# EAGLE design 2016_A_mother (EAGLE 6.2)
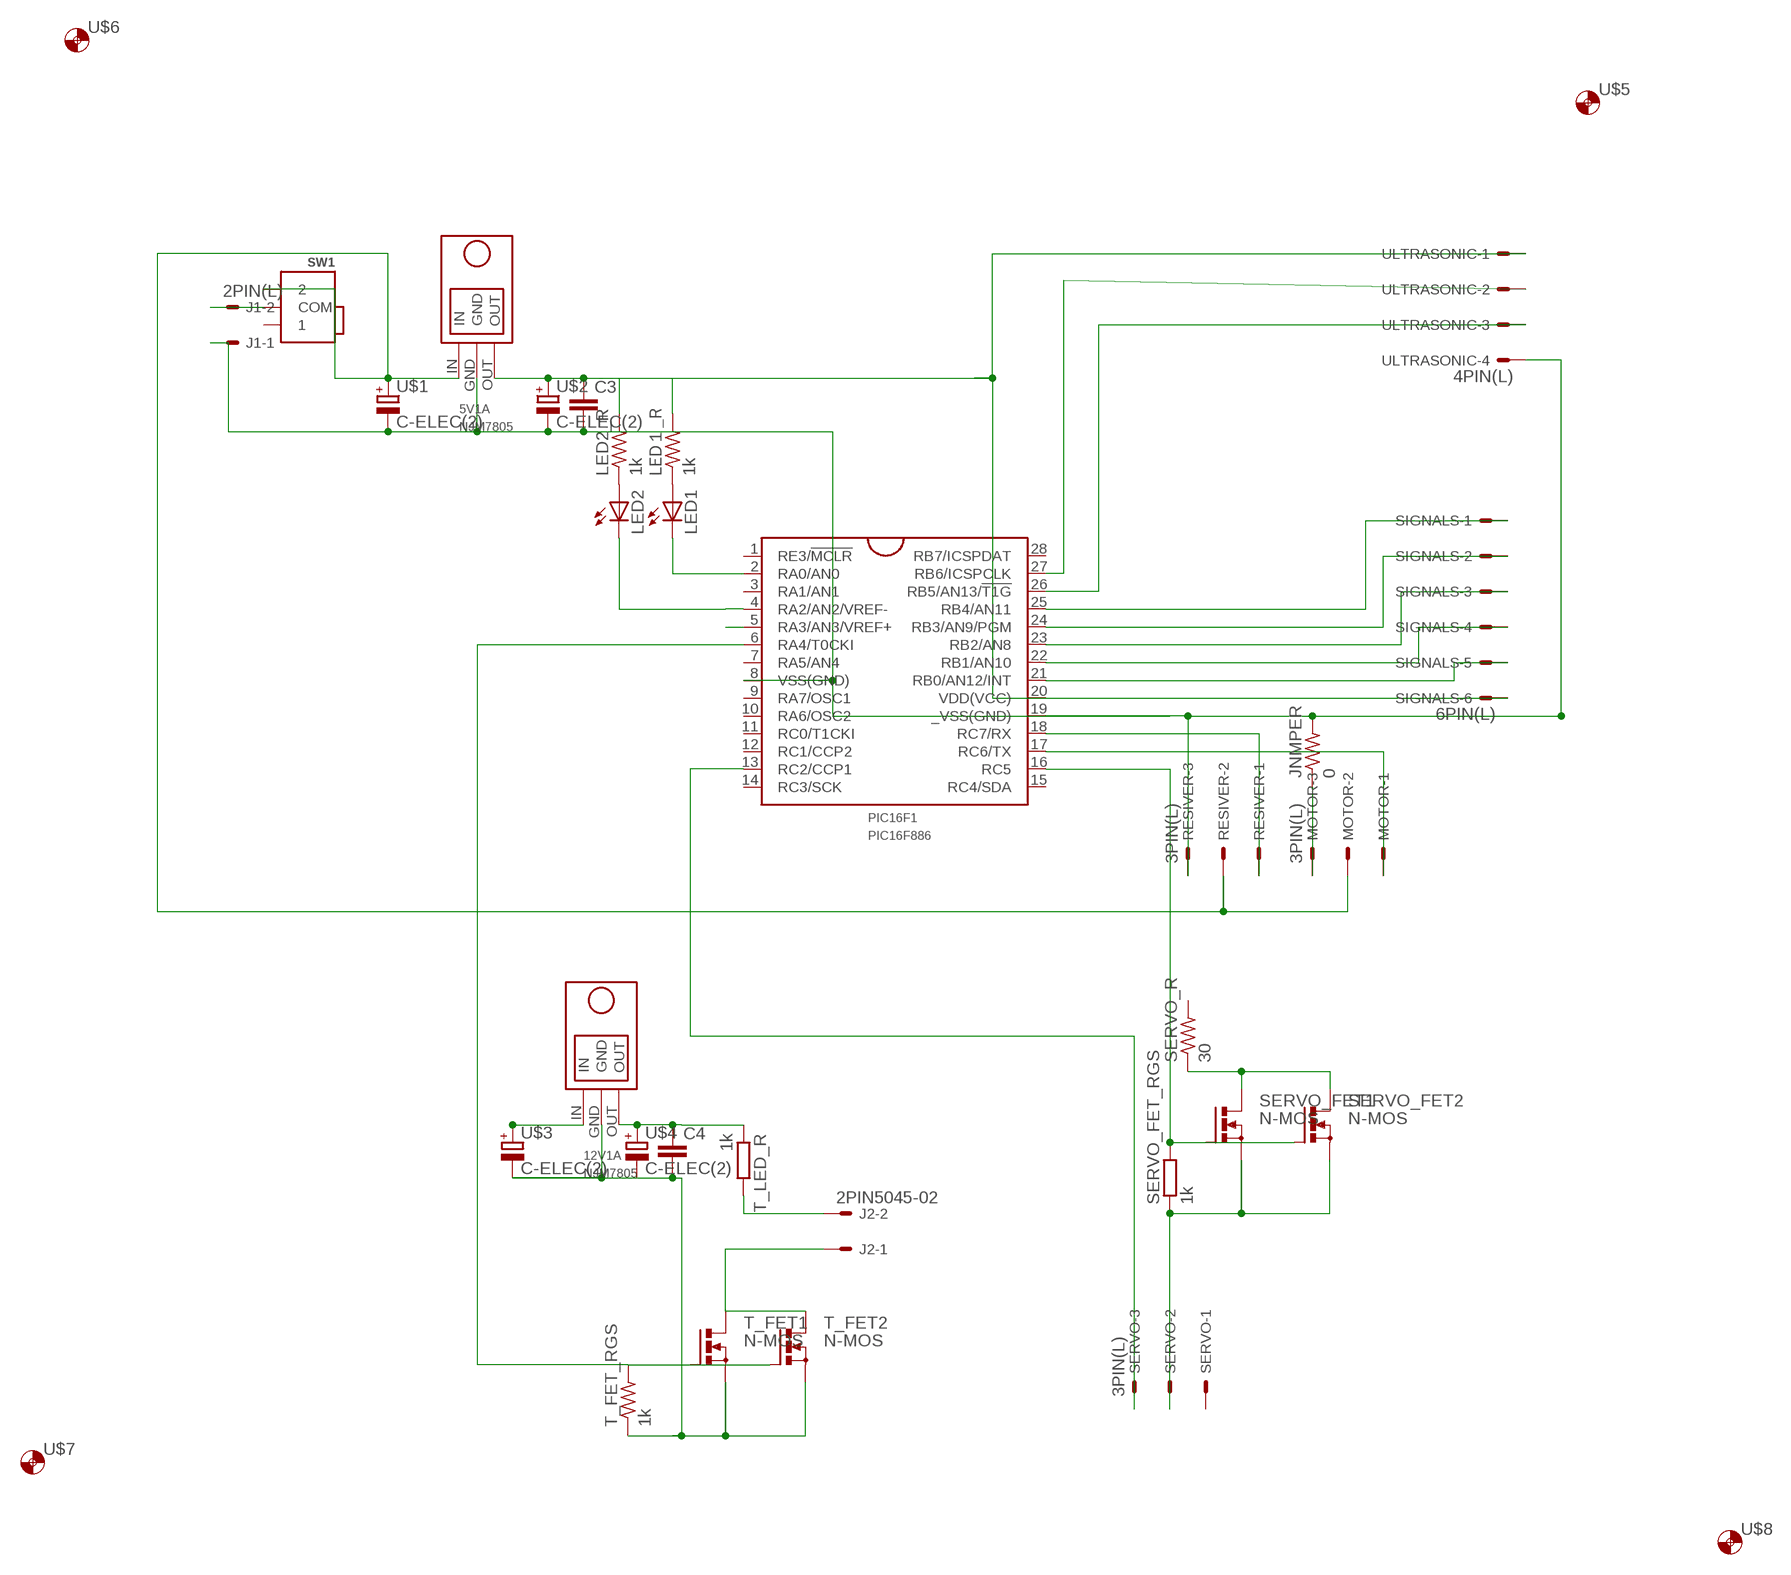
[diagram p0: schematic, sheet 1]

## Parts
5V1A  NJM7805  [NJM7805]
12V1A  NJM7805  [NJM7805]
C3  C-  [C-2.54]
C4  C-  [C-2.54]
J1  2PIN(L)  [2PL]
J2  2PIN5045-02  [5045-02]
JNMPER  0  R-  [0207/10]
LED1  LED  [LED5MM]
LED2  LED-2  [LED5MM-2]
LED2_R  1k  R-  [0207/10]
LED１_R  1k  R-  [0207/10]
MOTOR  3PIN(L)  [3PL]
PIC16F1  PIC16F886  [DIL28-3]
RESIVER  3PIN(L)  [3PL]
SERVO  3PIN(L)  [3PL]
SERVO_FET1  N-MOS  [TO220BV]
SERVO_FET2  N-MOS  [TO220BV]
SERVO_FET_RGS  1k  R-EU2R0207V  [R0207V]
SERVO_R  30  R-  [0207/10]
SIGNALS  6PIN(L)  [6PL]
SW1  SWITCH_MININORMAL  [SWITCH_MINI]
T_FET1  N-MOS  [TO220BV]
T_FET2  N-MOS  [TO220BV]
T_FET_RGS  1k  R-  [0207/10]
T_LED_R  1k  R-EU2R0207V  [R0207V]
U$1  C-ELEC(2)  [C-6MM(2)]
U$2  C-ELEC(2)  [C-6MM(2)]
U$3  C-ELEC(2)  [C-6MM(2)]
U$4  C-ELEC(2)  [C-6MM(2)]
U$5  1MMDRILL  [1MDRILL]
U$6  1MMDRILL  [1MDRILL]
U$7  1MMDRILL  [1MDRILL]
U$8  1MMDRILL  [1MDRILL]
ULTRASONIC  4PIN(L)  [4PL]

## Nets
5V: 5V1A.OUT C3.P$1 LED2_R.2 LED１_R.2 PIC16F1.20(VDD(VCC)) SIGNALS.6 U$2.+ ULTRASONIC.1
9V: 5V1A.IN MOTOR.2 RESIVER.2 SW1.2 U$1.+
12V: 12V1A.OUT C4.P$1 T_LED_R.1 U$4.+
G: PIC16F1.16(RC5) SERVO_FET1.G SERVO_FET2.G SERVO_FET_RGS.2
GND: 5V1A.GND C3.P$2 J1.1 JNMPER.2 PIC16F1.8(VSS(GND)) PIC16F1.19(_VSS(GND)) RESIVER.3 U$1.- U$2.- ULTRASONIC.4
LI-FE: 12V1A.IN U$3.+
MOTOR_SIGNAL: MOTOR.1 PIC16F1.17(RC6/TX)
N$1: J1.2 SW1.COM
N$2: PIC16F1.21(RB0/AN12/INT) SIGNALS.5
N$3: PIC16F1.22(RB1/AN10) SIGNALS.4
N$4: PIC16F1.23(RB2/AN8) SIGNALS.3
N$5: PIC16F1.24(RB3/AN9/PGM) SIGNALS.2
N$6: PIC16F1.25(RB4/AN11) SIGNALS.1
N$7: LED1.A LED１_R.1
N$8: LED1.K(C) PIC16F1.2(RA0/AN0)
N$9: J2.P$1 T_LED_R.2
N$10: J2.P$2 T_FET1.D T_FET2.D
N$11: JNMPER.1 MOTOR.3
N$13: PIC16F1.26(RB5/AN13/!T1G) ULTRASONIC.3
N$14: PIC16F1.27(RB6/ICSPCLK) ULTRASONIC.2
N$15: LED2.K(C) PIC16F1.4(RA2/AN2/VREF-)
N$16: LED2.A LED2_R.1
N$17: SERVO_FET1.D SERVO_FET2.D SERVO_R.1
N$18: PIC16F1.13(RC2/CCP1) SERVO.3
N$19: SERVO.2 SERVO_FET1.S SERVO_FET2.S SERVO_FET_RGS.1
N$21: PIC16F1.5(RA3/AN3/VREF+)
T_GND: 12V1A.GND C4.P$2 T_FET1.S T_FET2.S T_FET_RGS.1 U$3.- U$4.-
T_VGS: PIC16F1.6(RA4/T0CKI) T_FET1.G T_FET2.G T_FET_RGS.2
XBEE_SIGNAL: PIC16F1.18(RC7/RX) RESIVER.1
Unconnected: PIC16F1.1(RE3/!MCLR) PIC16F1.3(RA1/AN1) PIC16F1.7(RA5/AN4) PIC16F1.9(RA7/OSC1) PIC16F1.10(RA6/OSC2) PIC16F1.11(RC0/T1CKI) PIC16F1.12(RC1/CCP2) PIC16F1.14(RC3/SCK) PIC16F1.15(RC4/SDA) PIC16F1.28(RB7/ICSPDAT) SERVO.1 SERVO_R.2 SW1.1

## Library data of the parts
5V1A 12V1A = My_NJM7805:NJM7805
C3 C4 = My_rcl:C-
J1 = my_connector:2PIN(L)
J2 = 5051:2PIN
JNMPER LED2_R LED１_R SERVO_R T_FET_RGS = My_rcl:R-: Resistor
LED1 = my_led:LED: LED
LED2 = my_led:LED-2
MOTOR RESIVER SERVO = my_connector:3PIN(L)
PIC16F1 = FixLib:PIC16F886
SERVO_FET1 SERVO_FET2 T_FET1 T_FET2 = FET_kai:N-MOS
SERVO_FET_RGS T_LED_R = FP-21T for MITS:R-EU2
SIGNALS = my_connector:6PIN(L)
SW1 = FP-21T for MITS:SWITCH_MINI: Switch 5.08mm
U$1-U$4 = My_rcl:C-ELEC(2)
U$5-U$8 = Orig_Lib:1MMDRILL
ULTRASONIC = my_connector:4PIN(L)

## Board
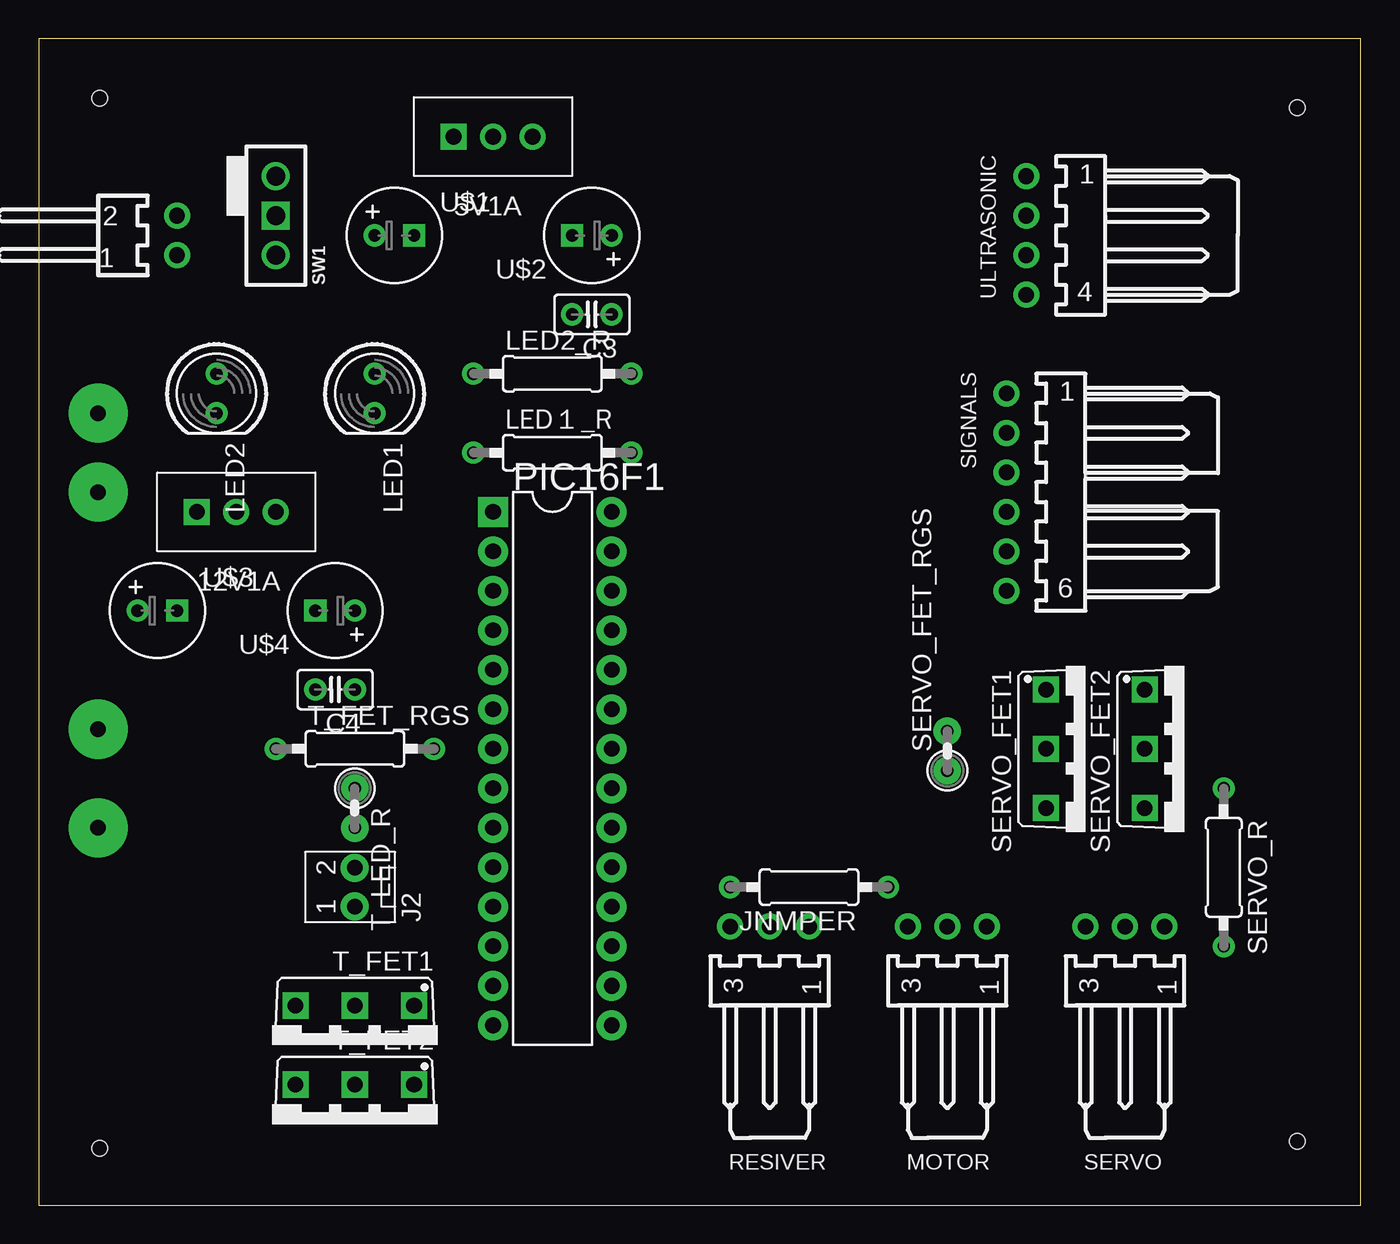
[diagram p1: board, top side]
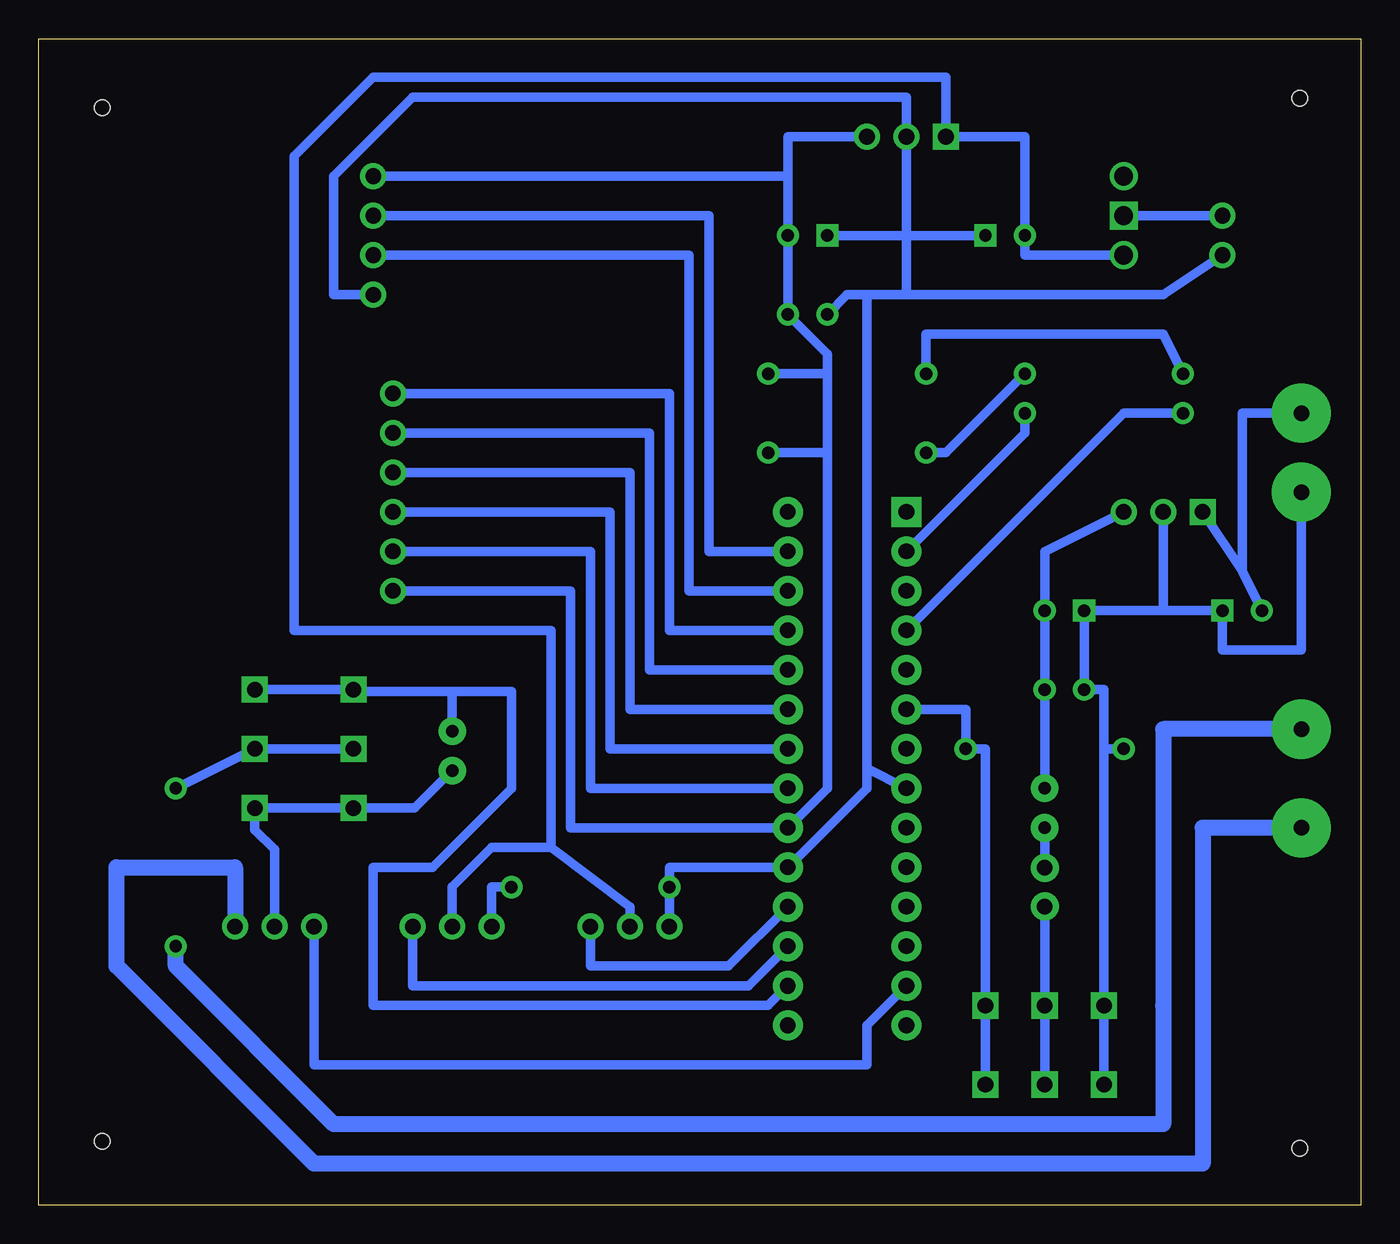
[diagram p2: board, bottom side, seen from below]

Size 85 x 75 mm. Coordinates in mm from the lower left corner, seen from the top.
Outline: 0,0 85,0 85,75 0,75 0,0
Copper layers (1*16): Top 0.035mm / dielectric 1.5mm / Bottom 0.035mm
Design rules: minimum track width 10mil, minimum drill 24mil, track to track 8mil, track to pad 8mil, pad to pad 8mil, via to via 8mil, smd to smd 8mil, copper to edge 40mil, drill to drill 8mil, minimum pad ring 10mil, minimum via ring 8mil, stop-mask expansion 4mil, vias tented up to drill 0mil, thermal gap 10mil

### Footprints (pad centres in the part's own frame; a part is rotated, then mirrored left to right if it is on the bottom)
NJM7805 = drill 1 pad 1.676: GND 0,0; OUT 2.54,0 | drill 1 pad 1.676 square: IN -2.54,0
C-2.54 = drill 0.8 pad 1.422: P$1 -1.27,0; P$2 1.27,0
2PL = drill 1 pad 1.676: 1 -1.27,-7.62; 2 1.27,-7.62
5045-02 = drill 1 pad 1.8: P$1 -1.25,0; P$2 1.25,0
0207/10 = drill 0.8 pad 1.422: 1 -5.08,0; 2 5.08,0
LED5MM = drill 0.8 pad 1.422: A -1.27,0; K 1.27,0
LED5MM-2 = drill 0.8 pad 1.422: A -1.27,0; K 1.27,0
3PL = drill 1 pad 1.676: 1 -2.54,-7.62; 2 0,-7.62; 3 2.54,-7.62
DIL28-3 = drill 1 pad 1.93 square: 1 -16.51,-3.81 | drill 1 pad 1.93: 2 -13.97,-3.81; 3 -11.43,-3.81; 4 -8.89,-3.81; 5 -6.35,-3.81; 6 -3.81,-3.81; 7 -1.27,-3.81; 8 1.27,-3.81; 9 3.81,-3.81; 10 6.35,-3.81; 11 8.89,-3.81; 12 11.43,-3.81; 13 13.97,-3.81; 14 16.51,-3.81; 15 16.51,3.81; 16 13.97,3.81; 17 11.43,3.81; 18 8.89,3.81; 19 6.35,3.81; 20 3.81,3.81; 21 1.27,3.81; 22 -1.27,3.81; 23 -3.81,3.81; 24 -6.35,3.81; 25 -8.89,3.81; 26 -11.43,3.81; 27 -13.97,3.81; 28 -16.51,3.81
TO220BV = drill 1 pad 1.676 square: D 0,0; G -3.81,0; S 3.81,0
R0207V = drill 0.8 pad 1.778: 1 -1.27,0; 2 1.27,0
6PL = drill 1 pad 1.676: 1 -6.35,-6.35; 2 -3.81,-6.35; 3 -1.27,-6.35; 4 1.27,-6.35; 5 3.81,-6.35; 6 6.35,-6.35
SWITCH_MINI = drill 1.2 pad 1.8: 1 0,2.54; 2 0,-2.54 | drill 1.2 pad 1.8 square: COM 0,0
C-6MM(2) = drill 0.8 pad 1.422: + -1.27,0 | drill 0.8 pad 1.422 square: - 1.27,0
1MDRILL = hole 1: 0,0
4PL = drill 1 pad 1.676: 1 -3.81,-6.35; 2 -1.27,-6.35; 3 1.27,-6.35; 4 3.81,-6.35

### Placement (x,y rotation side)
5V1A  29.21,68.71 0 top
12V1A  12.7,44.58 0 top
C3  35.56,57.28 180 top
C4  19.05,33.15 180 top
J1  1.27,62.36 90 top
J2  20.32,20.45 270 top
JNMPER  49.53,20.45 180 top
LED1  21.59,52.2 270 top
LED2  11.43,52.2 270 top
LED2_R  33.02,53.47 0 top
LED１_R  33.02,48.39 0 top
MOTOR  58.42,10.29 180 top
PIC16F1  33.02,28.07 270 top
RESIVER  46.99,10.29 180 top
SERVO  69.85,10.29 180 top
SERVO_FET1  64.77,29.34 270 top
SERVO_FET2  71.12,29.34 270 top
SERVO_FET_RGS  58.42,29.21 90 top
SERVO_R  76.2,21.72 270 top
SIGNALS  68.58,45.85 270 top
SW1  15.24,63.63 0 top
T_FET1  20.32,12.83 180 top
T_FET2  20.32,7.75 180 top
T_FET_RGS  20.32,29.34 0 top
T_LED_R  20.32,25.53 270 top
U$1  22.86,62.36 0 top
U$2  35.56,62.36 180 top
U$3  7.62,38.23 0 top
U$4  19.05,38.23 180 top
U$5  80.92,70.57 0 top
U$6  3.92,71.19 0 top
U$7  3.92,3.65 0 top
U$8  80.92,4.11 0 top
ULTRASONIC  69.85,62.36 270 top

### Tracks (layer width: path | path; a pad name or v marks a point on that pad's centre or on a via)
5V
  Bottom 0.61: 5V1A.OUT 36.83,68.71 36.83,66.17 | 36.83,66.17 U$2.+ C3.P$1 34.29,54.74 | 34.29,54.74 34.29,53.47 | 34.29,53.47 34.29,48.39 | 34.29,48.39 34.29,26.8 PIC16F1.20 50.8,24.26 50.8,39.5 SIGNALS.6 | 34.29,54.74 34.29,53.47 | 34.29,53.47 LED2_R.2 34.29,53.47 | 34.29,53.47 34.29,48.39 | 34.29,48.39 LED１_R.2 | ULTRASONIC.1 36.83,66.17
9V
  Bottom 0.61: 21.59,61.09 SW1.2 21.59,61.09 | 21.59,61.09 U$1.+ | U$1.+ 21.59,68.71 | 21.59,68.71 5V1A.IN | 21.59,61.09 U$1.+ | U$1.+ 21.59,68.71 | 21.59,68.71 5V1A.IN | RESIVER.2 46.99,19.18 52.07,22.99 | 52.07,22.99 55.88,22.99 58.42,20.45 MOTOR.2 | 52.07,22.99 52.07,36.96 68.58,36.96 68.58,67.44 63.5,72.52 55.88,72.52 27.94,72.52 26.67,72.52 5V1A.IN
12V
  Bottom 0.61: 12V1A.OUT 20.32,42.04 U$4.+ C4.P$1 T_LED_R.1
G
  Bottom 0.61: PIC16F1.16 38.1,12.83 63.5,12.83 63.5,21.72 59.69,21.72 54.61,26.8 54.61,31.88 54.61,33.02 58.42,33.02 | 58.42,33.02 64.77,33.02 SERVO_FET1.G SERVO_FET2.G | SERVO_FET_RGS.2 58.42,33.02
GND
  Bottom 0.61: J1.1 12.7,58.55 29.21,58.55 | 29.21,58.55 29.21,61.09 29.21,62.36 | 29.21,62.36 5V1A.GND 29.21,71.25 60.96,71.25 66.04,66.17 66.04,58.55 ULTRASONIC.4 | U$1.- 29.21,62.36 | U$2.- 29.21,62.36 | 29.21,58.55 31.75,58.55 | 31.75,58.55 31.75,28.07 | 31.75,28.07 PIC16F1.8 | 31.75,28.07 31.75,26.8 PIC16F1.19 44.45,21.72 JNMPER.2 RESIVER.3 | 31.75,58.55 33.02,58.55 C3.P$2
LI-FE  (via drill 1 pad 3.81)
  Bottom 0.61: v3.81,50.93 7.62,50.93 7.62,40.77 | 7.62,40.77 U$3.+ | 12V1A.IN 7.62,40.77
MOTOR_SIGNAL
  Bottom 0.61: PIC16F1.17 39.37,14.1 60.96,14.1 MOTOR.1
N$1
  Bottom 0.61: J1.2 SW1.COM
N$2
  Bottom 0.61: PIC16F1.21 49.53,26.8 49.53,42.04 SIGNALS.5
N$3
  Bottom 0.61: SIGNALS.4 48.26,44.58 48.26,29.34 PIC16F1.22
N$4
  Bottom 0.61: SIGNALS.3 46.99,47.12 46.99,42.04 46.99,31.88 PIC16F1.23
N$5
  Bottom 0.61: SIGNALS.2 48.26,49.66 45.72,49.66 45.72,34.42 44.45,34.42 PIC16F1.24
N$6
  Bottom 0.61: PIC16F1.25 43.18,36.96 44.45,36.96 44.45,52.2 SIGNALS.1
N$7
  Bottom 0.61: LED１_R.1 26.67,48.39 LED1.A
N$8
  Bottom 0.61: LED1.K 21.59,49.66 PIC16F1.2
N$9
  Bottom 0.61: T_LED_R.2 J2.P$1
N$10
  Bottom 0.61: J2.P$2 T_FET1.D T_FET2.D
N$11
  Bottom 0.61: JNMPER.1 55.88,20.45 MOTOR.3
N$13
  Bottom 0.61: ULTRASONIC.3 43.18,61.09 43.18,57.28 43.18,39.5 38.1,39.5 PIC16F1.26
N$14
  Bottom 0.61: PIC16F1.27 41.91,42.04 41.91,47.12 41.91,63.63 ULTRASONIC.2
N$15
  Bottom 0.61: LED2.K 15.24,50.93 PIC16F1.4
N$16
  Bottom 0.61: LED2_R.1 27.94,56.01 12.7,56.01 LED2.A
N$17
  Bottom 0.61: SERVO_FET1.D SERVO_FET2.D SERVO_R.1
N$18
  Bottom 0.61: PIC16F1.13 31.75,11.56 31.75,9.02 67.31,9.02 SERVO.3
N$19
  Bottom 0.61: SERVO_FET1.S 69.85,25.53 | 69.85,25.53 SERVO_FET2.S | SERVO_FET1.S 69.85,25.53 | 69.85,25.53 SERVO_FET2.S | SERVO_FET2.S 69.85,25.53 | 69.85,25.53 SERVO_FET2.S | SERVO_FET2.S 71.12,24.13 69.85,22.86 SERVO.2 | SERVO_FET_RGS.1 60.83,25.53 SERVO_FET1.S
N$22  (via drill 1 pad 3.81)
  Bottom 1.016: v3.81,30.61 12.7,30.61 12.7,12.83 12.7,5.21 66.04,5.21 76.2,15.37 76.2,16.64
N$23  (via drill 1 pad 3.81)
  Bottom 1.016: v3.81,24.26 10.16,24.26 10.16,2.67 11.43,2.67 67.31,2.67 80.01,15.37 80.01,21.72 72.39,21.72 72.39,17.91
T_GND  (via drill 1 pad 3.81)
  Bottom 0.61: v3.81,45.85 3.81,44.58 3.81,35.69 8.89,35.69 U$3.- 12.7,38.23 | 12.7,38.23 12V1A.GND | 12.7,38.23 U$4.- C4.P$2 16.51,33.15 16.51,29.34 | T_FET_RGS.1 16.51,29.34 | 16.51,29.34 T_FET1.S T_FET2.S
T_VGS
  Bottom 0.61: PIC16F1.6 25.4,31.88 T_FET_RGS.2 24.13,29.34 T_FET1.G T_FET2.G
XBEE_SIGNAL
  Bottom 0.61: PIC16F1.18 40.64,15.37 49.53,15.37 RESIVER.1